# Altium project WOLF-RF_UNIT.PrjPCB
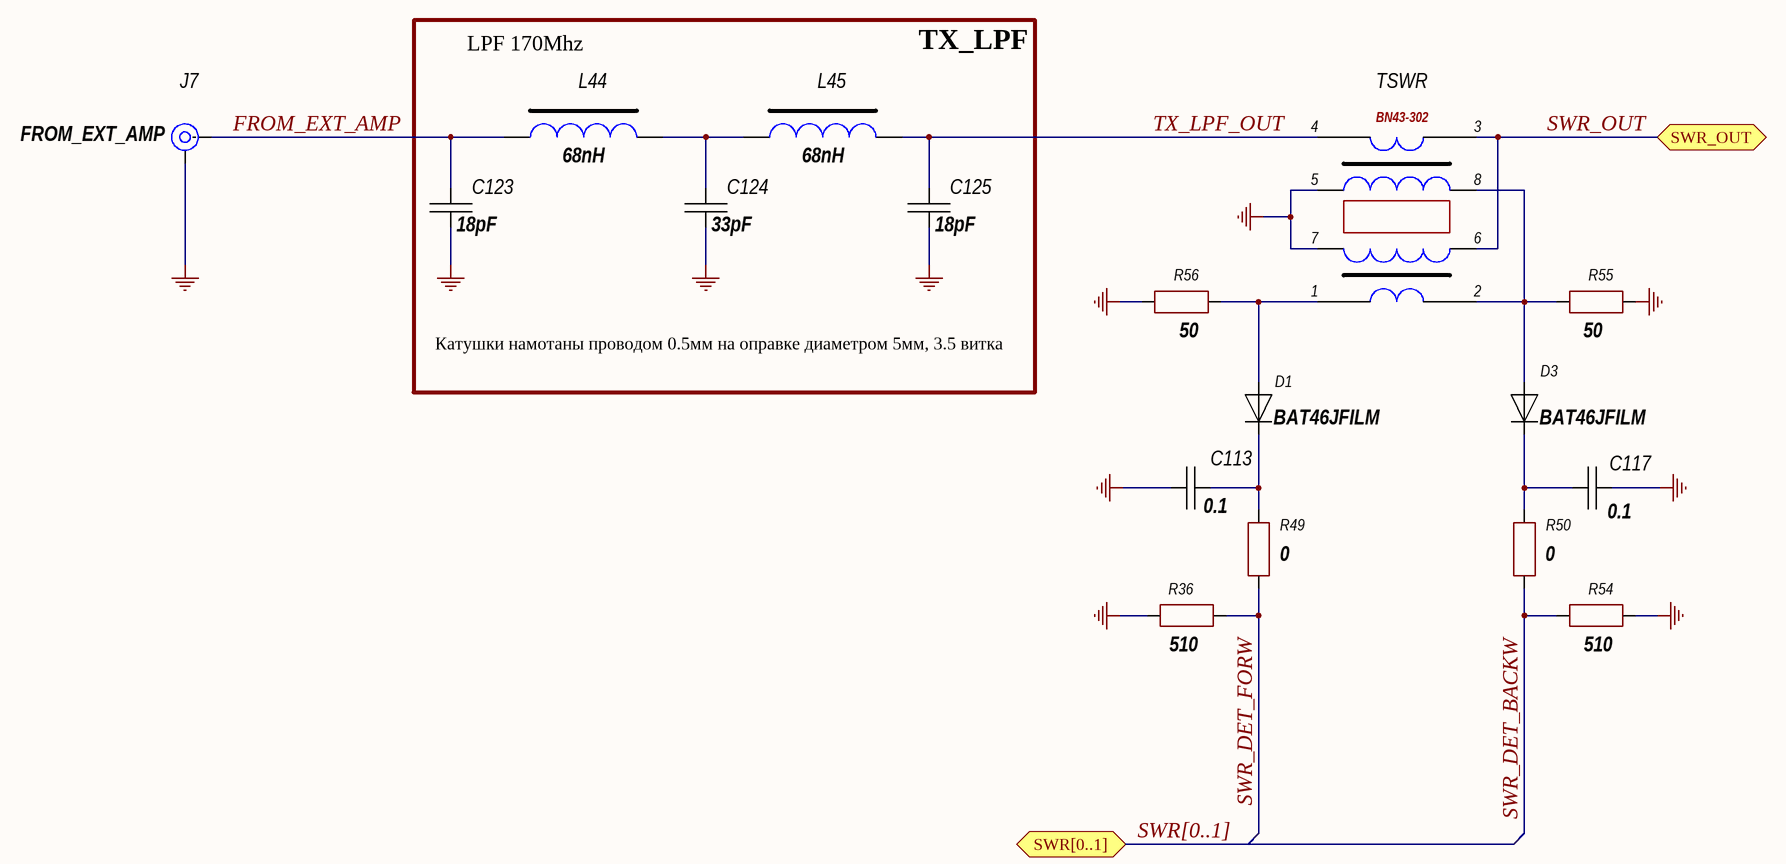
[diagram p0: WL-RF-SWR.SchDoc]
1 sheet, 17 parts. Net scope: flat (ports and power ports of the same name join across sheets).

## Sheet WL-RF-SWR.SchDoc
size 420 x 297 mm; Address1: Address1; Address2: Address2; Address3: Address3; Address4: Address4; DocumentNumber: WOLF-RF-UNIT; SheetNumber: 7; Scale: 1:1; DocumentType: Схема электрическая принципиальная; FirstReferrence: АБВГ.123456.001

### Parts
C113  0.1  [CH0805C]
C117  0.1  [CH0805C]
C123  18pF  [CH0805C]
C124  33pF  [CH0805C]
C125  18pF  [CH0805C]
D1  BAT46JFILM  [D9B]
D3  BAT46JFILM  [D9B]
J7  FROM_EXT_AMP  [CON: SMA]
L44  68nH
L45  68nH
R36  510  [CH1206R]
R49  0  [CH1206R]
R50  0  [CH1206R]
R54  510  [CH1206R]
R55  50  [CH1206R]
R56  50  [CH1206R]
TSWR  BN43-302  [TANDEM]

### Blocks framed on the sheet
TX_LPF: C123-C125 L44 L45

### Ports
SWR[0..1] (bidir), SWR_OUT (bidir)

### Nets
GND: C113.1 C117.1 C123.1 C124.1 C125.1 J7.2(IN) R36.1 R54.1 R55.1 R56.1 TSWR.5 TSWR.7
FROM_EXT_AMP: C123.2 J7.1(IN) L44.1
SWR_DET_BACKW: R50.1 R54.2
SWR_DET_FORW: R36.2 R49.1
SWR_OUT: TSWR.3 TSWR.6 ; port SWR_OUT
TX_LPF_OUT: C125.2 L45.2 TSWR.4
NetC113_2: C113.2 D1.2 R49.2
NetC117_2: C117.2 D3.2 R50.2
NetC124_2: C124.2 L44.2 L45.1
NetD1_1: D1.1 R56.2 TSWR.1
NetD3_1: D3.1 R55.2 TSWR.2 TSWR.8

### Buses and harness runs
bus SWR[0..1] = port SWR[0..1]

### Notes on the sheet
- LPF 170Mhz
- Катушки намотаны проводом 0.5мм на оправке диаметром 5мм, 3.5 витка
- Подп. и дата
- Инв. № дубл.
- Взам. инв. №
- Инв. № подл.
- Изм.
- Лист
- № докум.
- Подп.
- Дата
- 2.106-A3
- Копировал
- Формат А3

### Library data of the parts
C113 C117 C123-C125 = Capacitor: Manufacturer: *; Model: *; HelpURL: *; ComponentKind: *; Value: *
D1 D3 = Diod: ComponentKind: *; Manufacturer: *; Model: *; HelpURL: *
J7 = SMA: RF; Model: *; Manufacturer: *; HelpURL: *; ComponentKind: *
L44 L45 = TRANS
R36 R49 R50 R54-R56 = Resistor: Manufacturer: *; Model: *; HelpURL: *; ComponentKind: *; Value: *